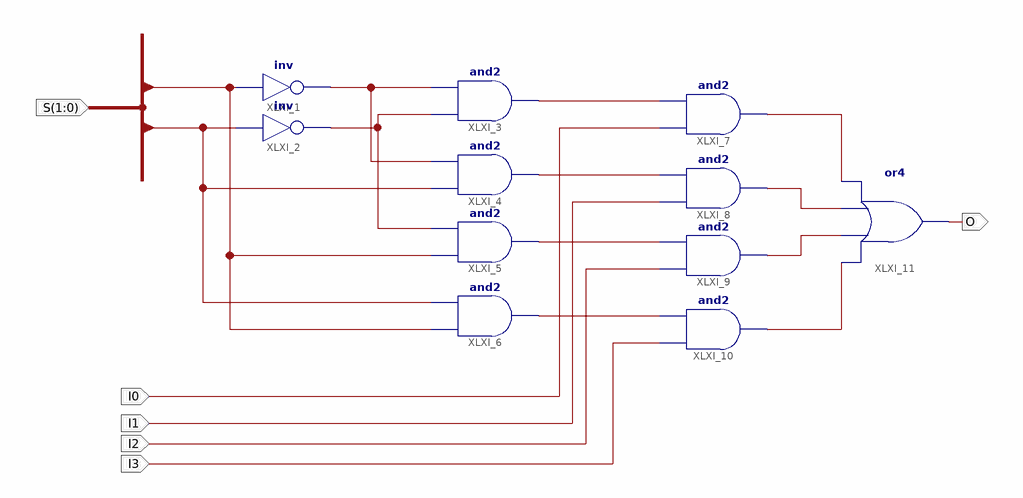
[diagram p0: schematic sheet 1]
// Xilinx ISE schematic MUX4to1.sch (kintex7) as structural Verilog: 11 symbols, 6 ports
module MUX4to1 (
  input  [1:0] S,
  input  I0,
  input  I1,
  input  I2,
  input  I3,
  output O
);

  wire XLXN_5, XLXN_6, XLXN_15, XLXN_16, XLXN_17, XLXN_18, XLXN_24, XLXN_26, XLXN_27, XLXN_28;

  not XLXI_1 (XLXN_5, S[1]);
  not XLXI_2 (XLXN_6, S[0]);
  and XLXI_3 (XLXN_15, XLXN_6, XLXN_5);
  and XLXI_4 (XLXN_16, S[0], XLXN_5);
  and XLXI_5 (XLXN_17, S[1], XLXN_6);
  and XLXI_6 (XLXN_18, S[1], S[0]);
  and XLXI_7 (XLXN_24, I0, XLXN_15);
  and XLXI_8 (XLXN_26, I1, XLXN_16);
  and XLXI_9 (XLXN_27, I2, XLXN_17);
  and XLXI_10 (XLXN_28, I3, XLXN_18);
  or XLXI_11 (O, XLXN_28, XLXN_27, XLXN_26, XLXN_24);
endmodule
